# EasyEDA schematic SCH_ESP32-S3_Project_2025-03-01.json
TITLE: OptiScan Model X yurr; REV: 1.0; Date: 2025-02-05; Sheet: 1/1; Drawn By: therealxgamer1; Company: yurr industries
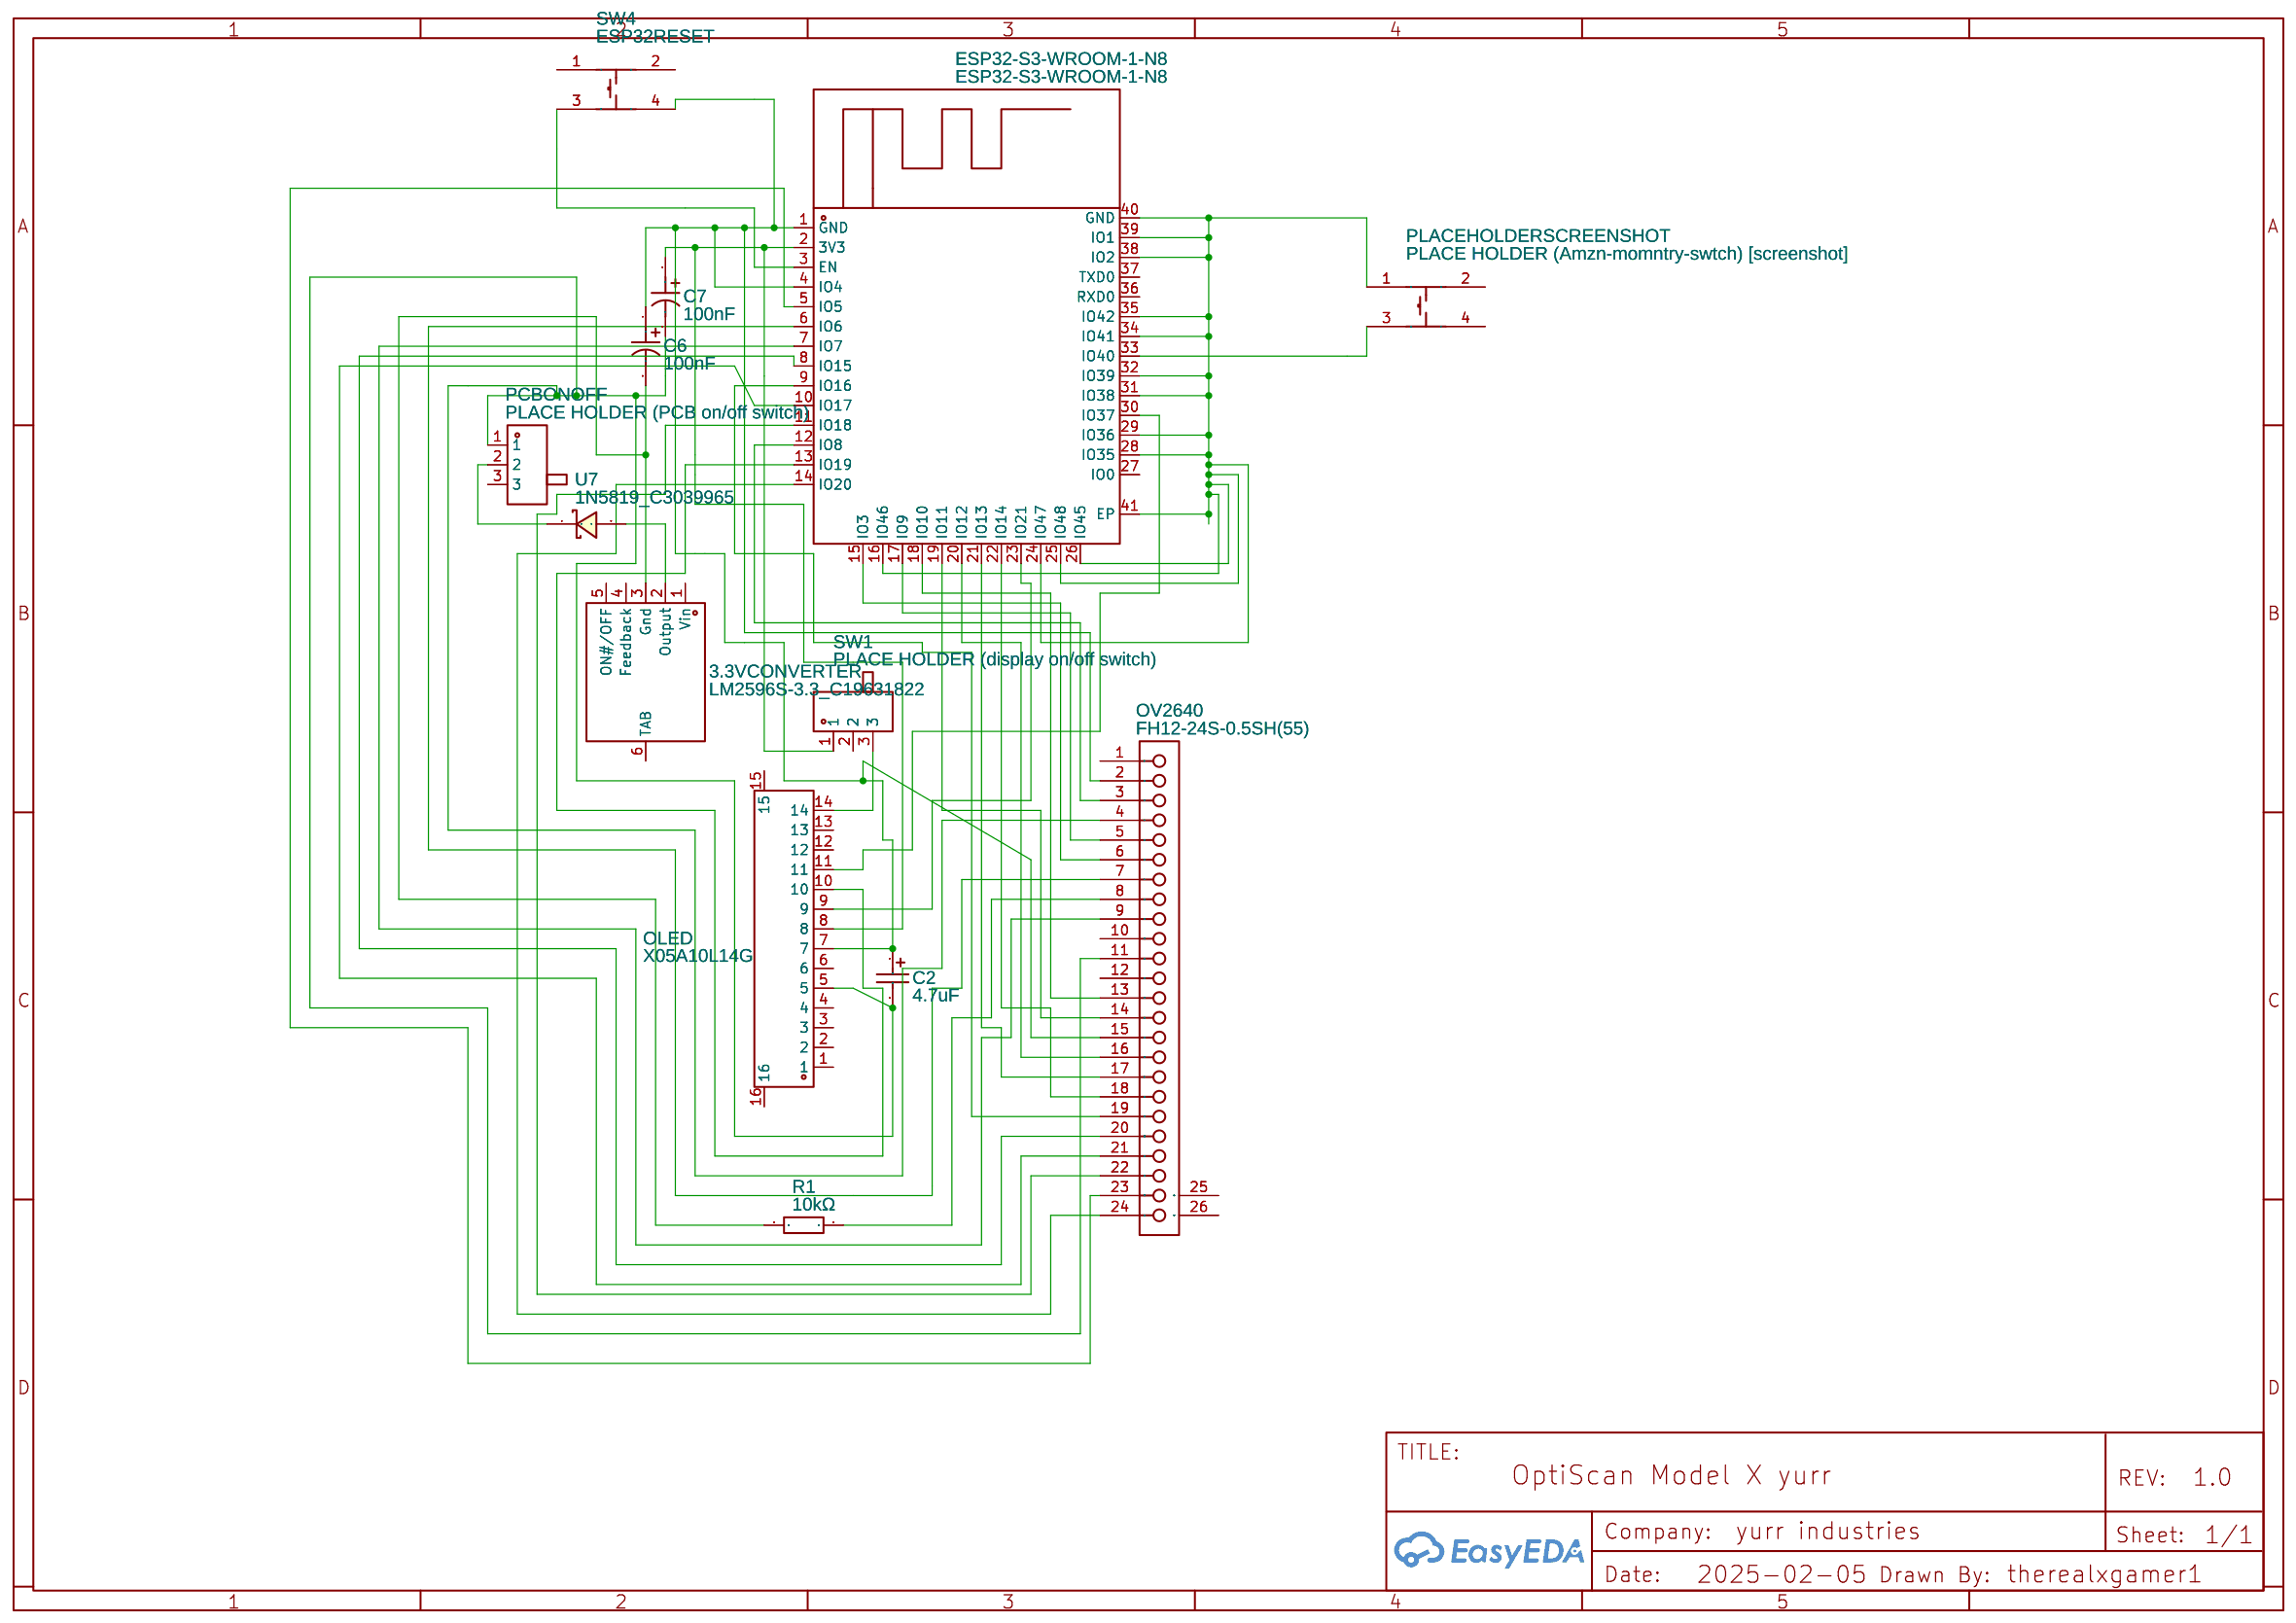
[diagram p0: schematic sheet]

## Parts
3.3VCONVERTER  LM2596S-3.3_C19631822  [TO-263-5_L10.2-W9.0-P1.70-TL-LS15.2]
C2  4.7uF  [CASE-A_3216]
C6  100nF  [CAP-SMD_L3.2-W1.6-FD]
C7  100nF  [CAP-SMD_L3.2-W1.6-FD]
ESP32-S3-WROOM-1-N8  ESP32-S3-WROOM-1-N8  [WIFIM-SMD_ESP32-S3-WROOM-1-N8]
OLED  X05A10L14G  [FPC-SMD_14P-P0.50_XKB_X05A10L14G]
OV2640  FH12-24S-0.5SH(55)  [FPC-SMD_FH12-24S-0.5SH-55]
PCBONOFF  PLACE HOLDER (PCB on/off switch)  [SW-SMD_SK-3245S-L4-A]
PLACEHOLDERSCREENSHOT  PLACE HOLDER (Amzn-momntry-swtch) [screenshot]  [KEY-SMD_4P-L6.0-W6.0-P4.50-LS9.5-BR]
R1  10kΩ  [R1206]
SW1  PLACE HOLDER (display on/off switch)  [SW-SMD_SK-3245S-L4-A]
SW4  ESP32RESET  [KEY-SMD_4P-L6.0-W6.0-P4.50-LS9.5-BR]
U7  1N5819_C3039965  [DO-41_BD2.4-L4.7-P8.70-D0.6-RD]

## Library data of the parts
3.3VCONVERTER = LM2596S-3.3_C19631822: Supplier: LCSC; Supplier Part: C19631822; Manufacturer: GR(国睿); Manufacturer Part: LM2596S-3.3; JLCPCB Part Class: Extended Part; Contributor: lcsc
C2 = CA45-A016K475T: Supplier: LCSC; Manufacturer: 湘怡中元/湘江; Supplier Part: C123256; JLCPCB Part Class: Extended Part
C6 C7 = T491A104M050AT: Contributor: lcsc; Supplier: LCSC; Supplier Part: C1952859; Manufacturer: KEMET(基美); JLCPCB Part Class: Extended Part
ESP32-S3-WROOM-1-N8 = ESP32-S3-WROOM-1-N8: Contributor: lcsc; Supplier: LCSC; Supplier Part: C2913198; Manufacturer: ESPRESSIF(乐鑫); JLCPCB Part Class: Extended Part
OLED = X05A10L14G: Contributor: LCSC; Supplier: LCSC; Supplier Part: C2880913; Manufacturer: XKB Connection(中国星坤); JLCPCB Part Class: Extended Part
OV2640 = FH12-24S-0.5SH(55): Contributor: LCSC; Supplier: LCSC; Supplier Part: C202112; Manufacturer: HRS(广濑); JLCPCB Part Class: Extended Part
PCBONOFF SW1 = SK-3245S-L4-A: Contributor: LCSC; Supplier: LCSC; Supplier Part: C500049; Manufacturer: XKB Connection(中国星坤); JLCPCB Part Class: Extended Part
PLACEHOLDERSCREENSHOT SW4 = TS-1002S-06026C: Contributor: LCSC; Supplier: LCSC; Supplier Part: C455112; Manufacturer: XUNPU(讯普); JLCPCB Part Class: Extended Part
R1 = 1206W4F1002T5E: Supplier: LCSC; Manufacturer: UNI-ROYAL(厚声); Supplier Part: C17902; JLCPCB Part Class: Basic Part
U7 = 1N5819_C3039965: Contributor: lcsc; Supplier: LCSC; Supplier Part: C3039965; Manufacturer: YFW(佑风微); Manufacturer Part: 1N5819; JLCPCB Part Class: Extended Part

## Nets
Net-(3.3VCONVERTER-2): 3.3VCONVERTER.2(Output) U7.2(A)
Net-(3.3VCONVERTER-3): 3.3VCONVERTER.3(Gnd) C6.2 R1.2
Net-(C2-1): C2.1 C6.1 ESP32-S3-WROOM-1-N8.1(GND) ESP32-S3-WROOM-1-N8.4(IO4) OLED.7 OV2640.2 OV2640.15 SW4.4
Net-(C2-2): C2.2 C7.2 OLED.5 OV2640.4 OV2640.11 PCBONOFF.1
Net-(C7-1): C7.1 ESP32-S3-WROOM-1-N8.2(3V3) OLED.8 SW1.1
Net-(ESP32-S3-WROOM-1-N8-3): ESP32-S3-WROOM-1-N8.3(EN) SW4.3
Net-(ESP32-S3-WROOM-1-N8-5): ESP32-S3-WROOM-1-N8.5(IO5) OV2640.23
Net-(ESP32-S3-WROOM-1-N8-6): ESP32-S3-WROOM-1-N8.6(IO6) OV2640.7
Net-(ESP32-S3-WROOM-1-N8-7): ESP32-S3-WROOM-1-N8.7(IO7) OV2640.9
Net-(ESP32-S3-WROOM-1-N8-8): ESP32-S3-WROOM-1-N8.8(IO15) OV2640.20
Net-(ESP32-S3-WROOM-1-N8-9): ESP32-S3-WROOM-1-N8.9(IO16) OV2640.19
Net-(ESP32-S3-WROOM-1-N8-10): ESP32-S3-WROOM-1-N8.10(IO17) OV2640.21
Net-(ESP32-S3-WROOM-1-N8-11): ESP32-S3-WROOM-1-N8.11(IO18) OV2640.22
Net-(ESP32-S3-WROOM-1-N8-12): ESP32-S3-WROOM-1-N8.12(IO8) OV2640.3
Net-(ESP32-S3-WROOM-1-N8-13): ESP32-S3-WROOM-1-N8.13(IO19) OLED.10
Net-(ESP32-S3-WROOM-1-N8-14): ESP32-S3-WROOM-1-N8.14(IO20) OV2640.24
Net-(ESP32-S3-WROOM-1-N8-15): ESP32-S3-WROOM-1-N8.15(IO3) OV2640.6
Net-(ESP32-S3-WROOM-1-N8-16): ESP32-S3-WROOM-1-N8.16(IO46) ESP32-S3-WROOM-1-N8.24(IO47) ESP32-S3-WROOM-1-N8.25(IO48) ESP32-S3-WROOM-1-N8.26(IO45) ESP32-S3-WROOM-1-N8.28(IO35) ESP32-S3-WROOM-1-N8.29(IO36) ESP32-S3-WROOM-1-N8.31(IO38) ESP32-S3-WROOM-1-N8.32(IO39) ESP32-S3-WROOM-1-N8.34(IO41) ESP32-S3-WROOM-1-N8.35(IO42) ESP32-S3-WROOM-1-N8.38(IO2) ESP32-S3-WROOM-1-N8.39(IO1) ESP32-S3-WROOM-1-N8.40(GND) ESP32-S3-WROOM-1-N8.41(EP) PLACEHOLDERSCREENSHOT.1
Net-(ESP32-S3-WROOM-1-N8-17): ESP32-S3-WROOM-1-N8.17(IO9) OV2640.5
Net-(ESP32-S3-WROOM-1-N8-18): ESP32-S3-WROOM-1-N8.18(IO10) OV2640.13
Net-(ESP32-S3-WROOM-1-N8-19): ESP32-S3-WROOM-1-N8.19(IO11) OV2640.14
Net-(ESP32-S3-WROOM-1-N8-20): ESP32-S3-WROOM-1-N8.20(IO12) OV2640.16
Net-(ESP32-S3-WROOM-1-N8-21): ESP32-S3-WROOM-1-N8.21(IO13) OV2640.17
Net-(ESP32-S3-WROOM-1-N8-22): ESP32-S3-WROOM-1-N8.22(IO14) OV2640.18
Net-(ESP32-S3-WROOM-1-N8-23): ESP32-S3-WROOM-1-N8.23(IO21) OLED.9
Net-(ESP32-S3-WROOM-1-N8-30): ESP32-S3-WROOM-1-N8.30(IO37) OLED.11
Net-(ESP32-S3-WROOM-1-N8-33): ESP32-S3-WROOM-1-N8.33(IO40) PLACEHOLDERSCREENSHOT.3
Net-(OLED-14): OLED.14 SW1.3
Net-(OV2640-8): OV2640.8 R1.1
Net-(PCBONOFF-2): PCBONOFF.2 U7.1(K)

Not connected (* = marked no-connect by the designer): 3.3VCONVERTER 1(Vin) 4(Feedback) 5(ON#/OFF) 6(TAB); ESP32-S3-WROOM-1-N8 27(IO0) 36(RXD0) 37(TXD0); OLED 1 2 3 4 6 12 13 15 16; OV2640 1 10 12 25 26; PCBONOFF 3; PLACEHOLDERSCREENSHOT 2 4; SW1 2; SW4 1 2
